# EasyEDA schematic SCH_New Project_2022-06-30.json
TITLE: Alarmclock; REV: 1.0; Date: 2022-05-12; Sheet: 1/1; Drawn By: Lukas; Company: TUN @FTU KIT
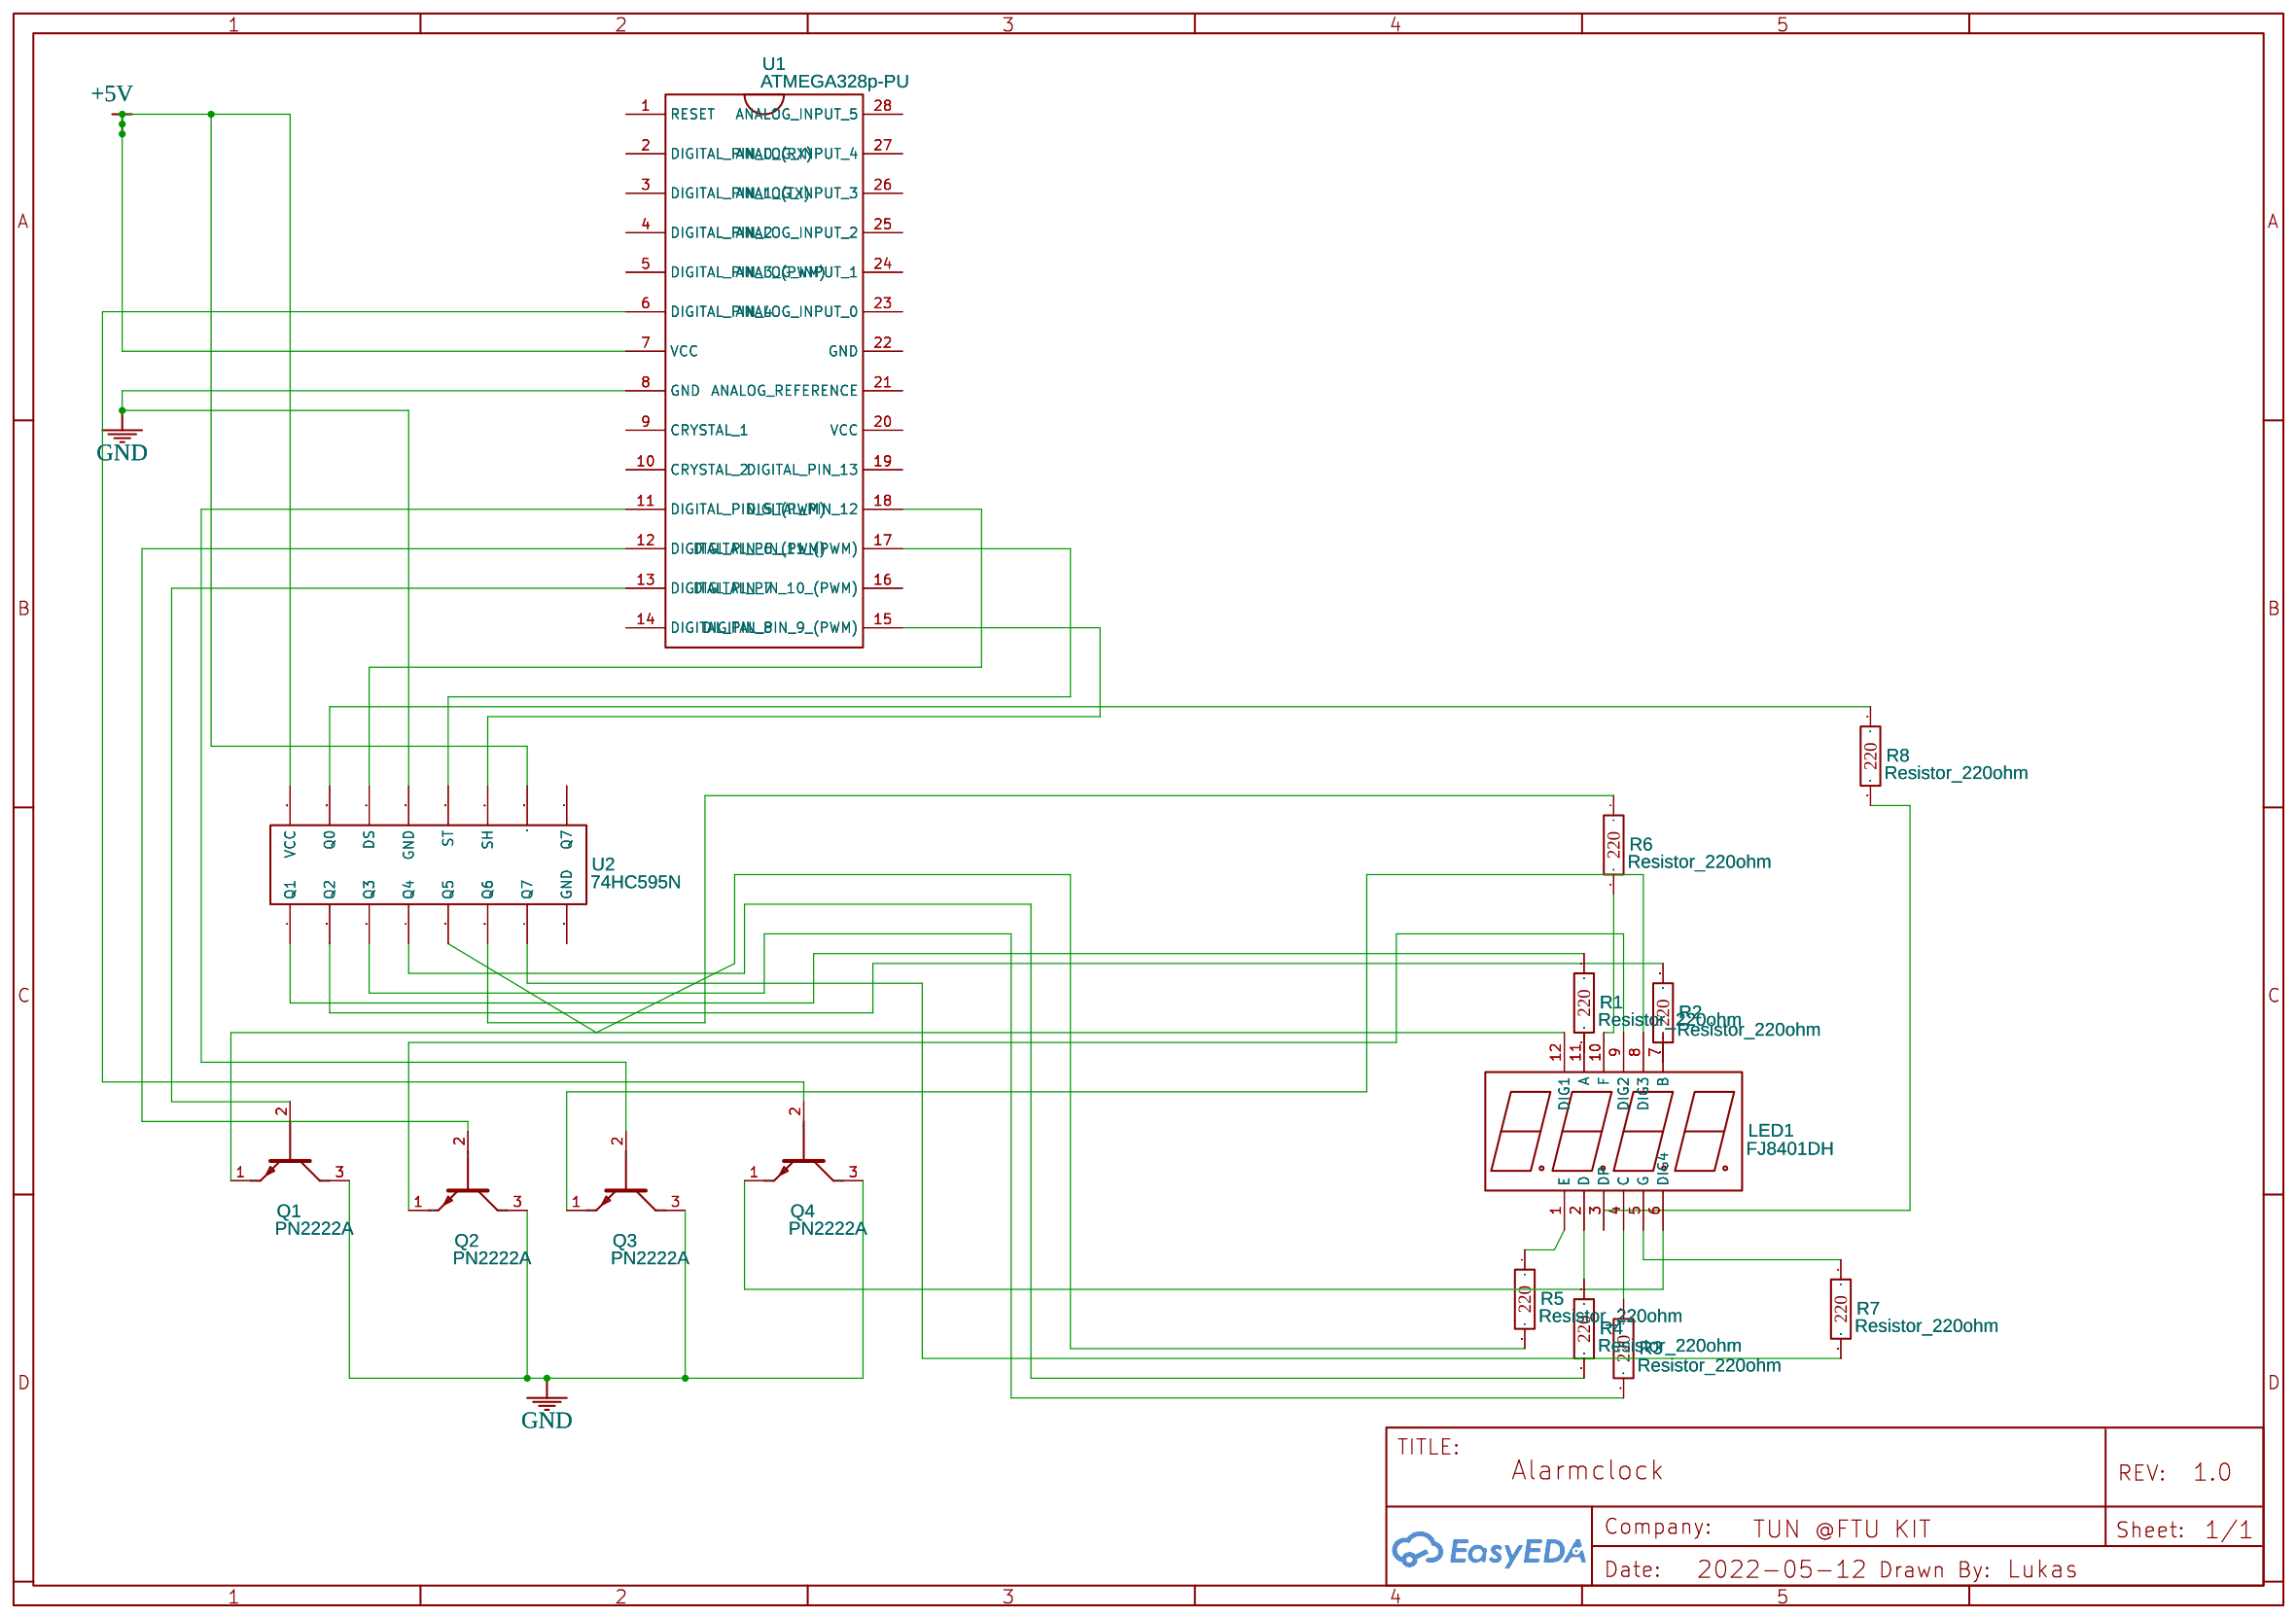
[diagram p0: schematic sheet]

## Parts
LED1  FJ8401DH  [LED-SEG-TH_12P-L71.5-W25.7-P2.54-S21.90-TL]
Q1  PN2222A  [PN2222A]
Q2  PN2222A  [PN2222A]
Q3  PN2222A  [PN2222A]
Q4  PN2222A  [PN2222A]
R1  Resistor_220ohm  [ER RESISTOR 220OHM]
R2  Resistor_220ohm  [ER RESISTOR 220OHM]
R3  Resistor_220ohm  [ER RESISTOR 220OHM]
R4  Resistor_220ohm  [ER RESISTOR 220OHM]
R5  Resistor_220ohm  [ER RESISTOR 220OHM]
R6  Resistor_220ohm  [ER RESISTOR 220OHM]
R7  Resistor_220ohm  [ER RESISTOR 220OHM]
R8  Resistor_220ohm  [ER RESISTOR 220OHM]
U1  ATMEGA328p-PU  [ATMEGA328P-PU PCB]
U2  74HC595N  [74HC595N]

## Library data of the parts
LED1 = FJ8401DH: Supplier: LCSC; Supplier Part: C70368; Manufacturer: Shenzhen Zhihao Elec; Contributor: LCSC; JLCPCB Part Class: Extended Part
Q1-Q4 = PN2222A: Contributor: Ryan Bluhm
R1-R8 = Resistor_220ohm: Supplier: Conrad; Contributor: George Edmonds
U1 = ATMEGA328p-PU: Contributor: jleethe2nd
U2 = 74HC595N: Contributor: craftwshop

## Nets
+5V: U1.7(VCC) U2.10 U2.16(VCC)
GND: Q1.3(C) Q2.3(C) Q3.3(C) Q4.3(C) U1.8(GND) U2.13(GND)
Net-(LED1-1): LED1.1(E) R5.1
Net-(LED1-2): LED1.2(D) R4.1
Net-(LED1-3): LED1.3(DP) R8.2
Net-(LED1-4): LED1.4(C) R3.1
Net-(LED1-5): LED1.5(G) R7.1
Net-(LED1-6): LED1.6(DIG4) Q4.1(E)
Net-(LED1-7): LED1.7(B) R2.2
Net-(LED1-8): LED1.8(DIG3) Q3.1(E)
Net-(LED1-9): LED1.9(DIG2) Q2.1(E)
Net-(LED1-10): LED1.10(F) R6.2
Net-(LED1-11): LED1.11(A) R1.2
Net-(LED1-12): LED1.12(DIG1) Q1.1(E)
Net-(Q1-2): Q1.2(B) U1.13(DIGITAL PIN 7)
Net-(Q2-2): Q2.2(B) U1.12(DIGITAL PIN 6 (PWM))
Net-(Q3-2): Q3.2(B) U1.11(DIGITAL PIN 5 (PWM))
Net-(Q4-2): Q4.2(B) U1.6(DIGITAL PIN 4)
Net-(R1-1): R1.1 U2.1(Q1)
Net-(R2-1): R2.1 U2.2(Q2)
Net-(R3-2): R3.2 U2.3(Q3)
Net-(R4-2): R4.2 U2.4(Q4)
Net-(R5-2): R5.2 U2.5(Q5)
Net-(R6-1): R6.1 U2.6(Q6)
Net-(R7-2): R7.2 U2.7(Q7)
Net-(R8-1): R8.1 U2.15(Q0)
Net-(U1-15): U1.15(DIGITAL PIN 9 (PWM)) U2.11(SH)
Net-(U1-17): U1.17(DIGITAL PIN 11 (PWM)) U2.12(ST)
Net-(U1-18): U1.18(DIGITAL PIN 12) U2.14(DS)

Not connected (* = marked no-connect by the designer): U1 1(RESET) 2(DIGITAL PIN 0 (RX)) 3(DIGITAL PIN 1 (TX)) 4(DIGITAL PIN 2) 5(DIGITAL PIN 3 (PWM)) 9(CRYSTAL 1) 10(CRYSTAL 2) 14(DIGITAL PIN 8) 16(DIGITAL PIN 10 (PWM)) 19(DIGITAL PIN 13) 20(VCC) 21(ANALOG REFERENCE) 22(GND) 23(ANALOG INPUT 0) 24(ANALOG INPUT 1) 25(ANALOG INPUT 2) 26(ANALOG INPUT 3) 27(ANALOG INPUT 4) 28(ANALOG INPUT 5); U2 8(GND) 9(Q7)
